# EAGLE design cyberspace-1-video-pico-card (EAGLE 9.6.2)
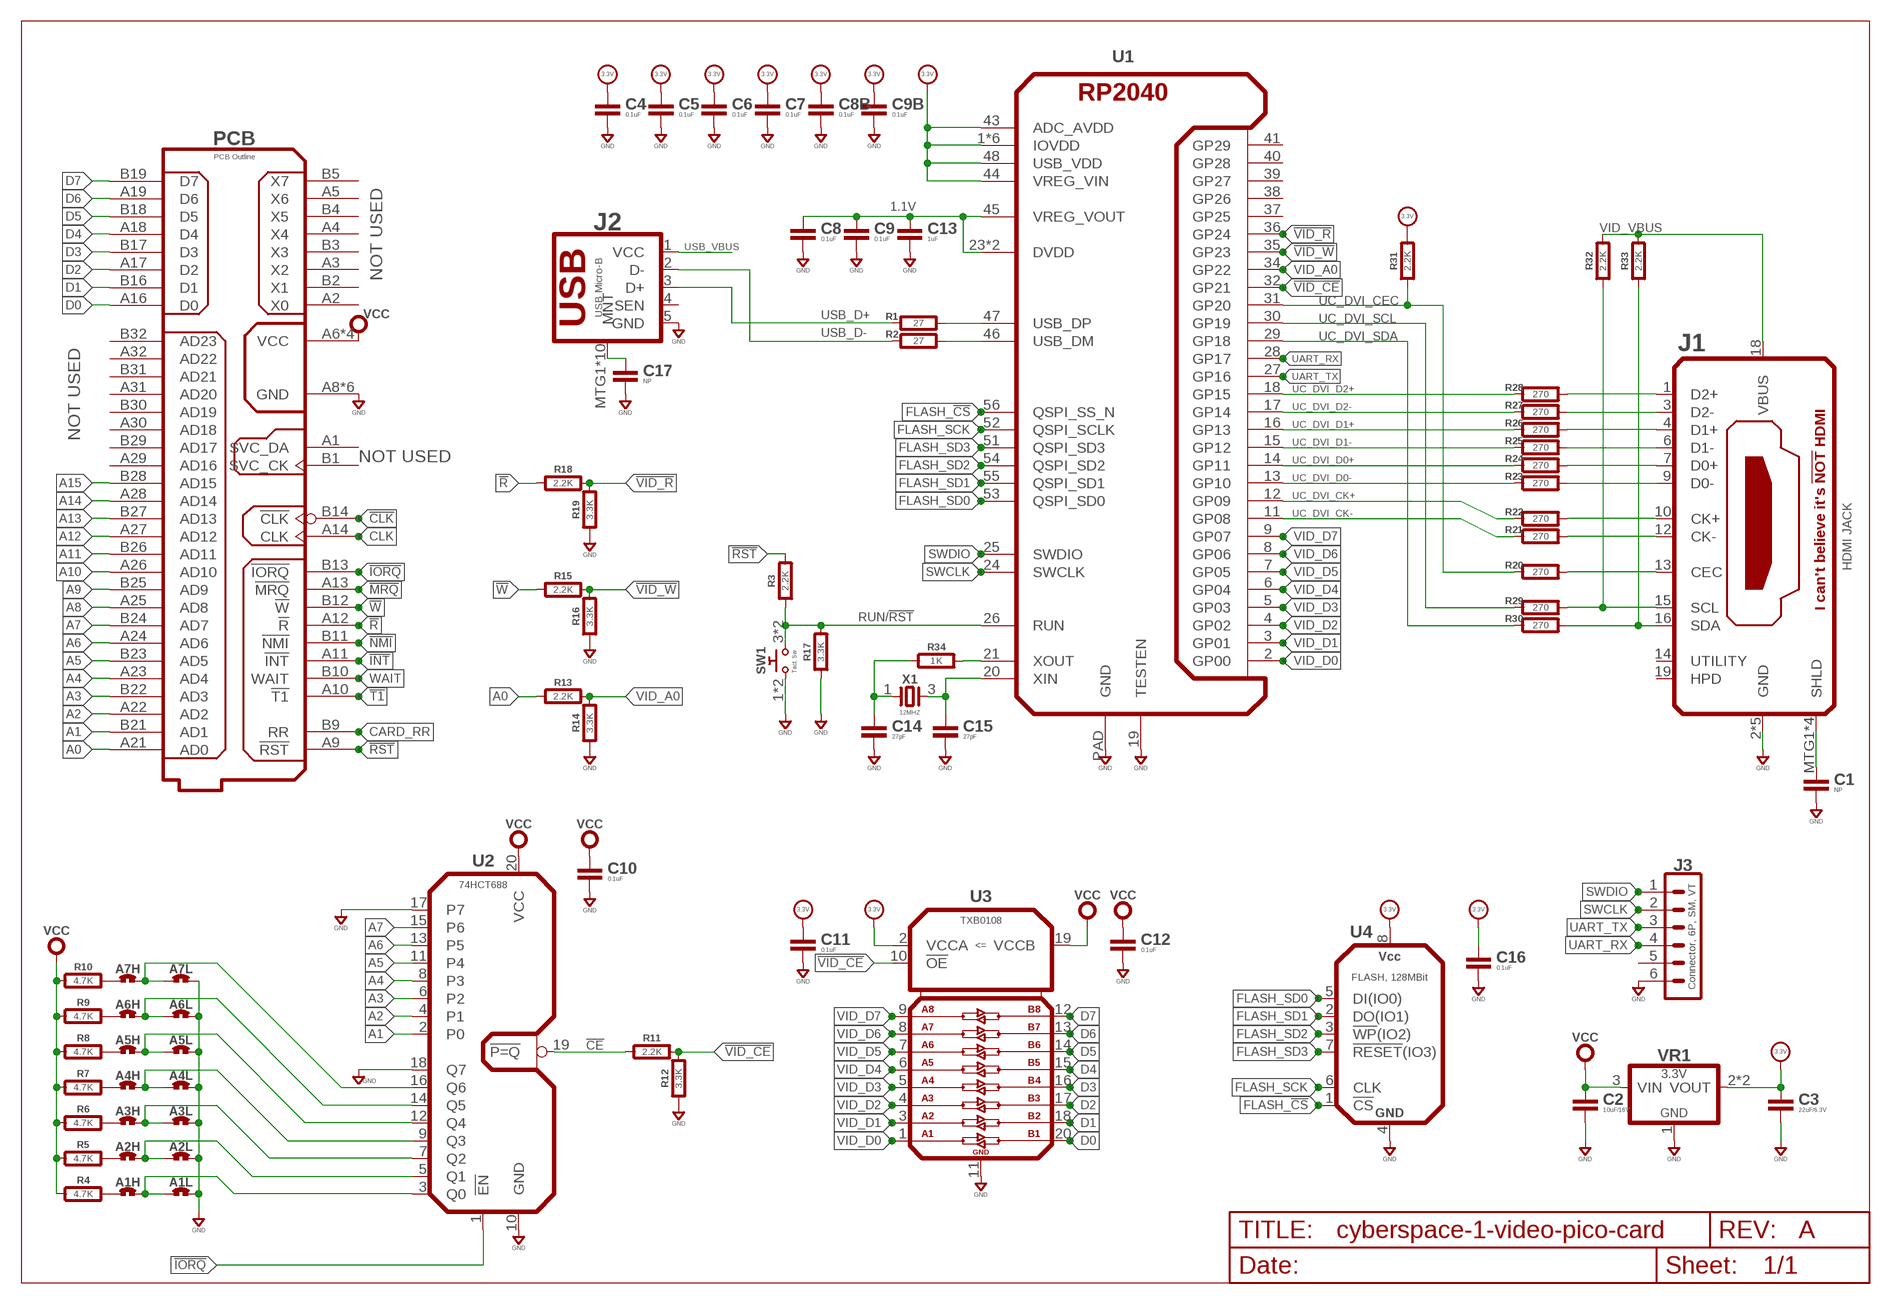
[diagram p0: schematic, sheet 1]
U$1 (DINA4_L-SMALLDOC): REV: A

## Parts
A1H  SOLDER_JUMPER-80MIL-RND  [SOLDER_JUMP_80MIL_RND]
A1L  SOLDER_JUMPER-80MIL-RND  [SOLDER_JUMP_80MIL_RND]
A2H  SOLDER_JUMPER-80MIL-RND  [SOLDER_JUMP_80MIL_RND]
A2L  SOLDER_JUMPER-80MIL-RND  [SOLDER_JUMP_80MIL_RND]
A3H  SOLDER_JUMPER-80MIL-RND  [SOLDER_JUMP_80MIL_RND]
A3L  SOLDER_JUMPER-80MIL-RND  [SOLDER_JUMP_80MIL_RND]
A4H  SOLDER_JUMPER-80MIL-RND  [SOLDER_JUMP_80MIL_RND]
A4L  SOLDER_JUMPER-80MIL-RND  [SOLDER_JUMP_80MIL_RND]
A5H  SOLDER_JUMPER-80MIL-RND  [SOLDER_JUMP_80MIL_RND]
A5L  SOLDER_JUMPER-80MIL-RND  [SOLDER_JUMP_80MIL_RND]
A6H  SOLDER_JUMPER-80MIL-RND  [SOLDER_JUMP_80MIL_RND]
A6L  SOLDER_JUMPER-80MIL-RND  [SOLDER_JUMP_80MIL_RND]
A7H  SOLDER_JUMPER-80MIL-RND  [SOLDER_JUMP_80MIL_RND]
A7L  SOLDER_JUMPER-80MIL-RND  [SOLDER_JUMP_80MIL_RND]
C1  NP  CAPACITOR0603  [0603-CAP]
C2  10uF/16V  CAPACITOR0805  [0805-CAP]
C3  22uF/6.3V  CAPACITOR0805  [0805-CAP]
C4  0.1uF  CAPACITOR0603  [0603-CAP]
C5  0.1uF  CAPACITOR0603  [0603-CAP]
C6  0.1uF  CAPACITOR0603  [0603-CAP]
C7  0.1uF  CAPACITOR0603  [0603-CAP]
C8  0.1uF  CAPACITOR0603  [0603-CAP]
C8B  0.1uF  CAPACITOR0603  [0603-CAP]
C9  0.1uF  CAPACITOR0603  [0603-CAP]
C9B  0.1uF  CAPACITOR0603  [0603-CAP]
C10  0.1uF  CAPACITOR0603  [0603-CAP]
C11  0.1uF  CAPACITOR0603  [0603-CAP]
C12  0.1uF  CAPACITOR0603  [0603-CAP]
C13  1uF  CAPACITOR0603  [0603-CAP]
C14  27pF  CAPACITOR0603  [0603-CAP]
C15  27pF  CAPACITOR0603  [0603-CAP]
C16  0.1uF  CAPACITOR0603  [0603-CAP]
C17  NP  CAPACITOR0603  [0603-CAP]
J1  HDMI JACK  HDMI-19JAE-DC1  [JAE-DC1-HDMI]
J2  USB Micro-B  USB-B-MICRO-SMTJAE-DX4R005  [JAE-DX4R005]
J3  Connector, 6P, SM, VT  06P-SM-VT-SMT  [BM06B-SRSS-TB]
PCB  PCB Outline  CYBERSPACE-1-CARD-1A  [CYBERSPACE-CARD-TYPE-1A]
R1  27  RESISTOR0603  [0603-RES]
R2  27  RESISTOR0603  [0603-RES]
R3  2.2K  RESISTOR0603  [0603-RES]
R4  4.7K  RESISTOR0603  [0603-RES]
R5  4.7K  RESISTOR0603  [0603-RES]
R6  4.7K  RESISTOR0603  [0603-RES]
R7  4.7K  RESISTOR0603  [0603-RES]
R8  4.7K  RESISTOR0603  [0603-RES]
R9  4.7K  RESISTOR0603  [0603-RES]
R10  4.7K  RESISTOR0603  [0603-RES]
R11  2.2K  RESISTOR0603  [0603-RES]
R12  3.3K  RESISTOR0603  [0603-RES]
R13  2.2K  RESISTOR0603  [0603-RES]
R14  3.3K  RESISTOR0603  [0603-RES]
R15  2.2K  RESISTOR0603  [0603-RES]
R16  3.3K  RESISTOR0603  [0603-RES]
R17  3.3K  RESISTOR0603  [0603-RES]
R18  2.2K  RESISTOR0603  [0603-RES]
R19  3.3K  RESISTOR0603  [0603-RES]
R20  270  RESISTOR0603  [0603-RES]
R21  270  RESISTOR0603  [0603-RES]
R22  270  RESISTOR0603  [0603-RES]
R23  270  RESISTOR0603  [0603-RES]
R24  270  RESISTOR0603  [0603-RES]
R25  270  RESISTOR0603  [0603-RES]
R26  270  RESISTOR0603  [0603-RES]
R27  270  RESISTOR0603  [0603-RES]
R28  270  RESISTOR0603  [0603-RES]
R29  270  RESISTOR0603  [0603-RES]
R30  270  RESISTOR0603  [0603-RES]
R31  2.2K  RESISTOR0603  [0603-RES]
R32  2.2K  RESISTOR0603  [0603-RES]
R33  2.2K  RESISTOR0603  [0603-RES]
R34  1K  RESISTOR0603  [0603-RES]
SW1  Tact. Sw.  PUSHBTN-MOMB3FS  [B3FS]
U1  RP2040-QFN  [QFN56-7X7]
U2  74HCT688  74HCT688PWR  [TSSOP20]
U3  TXB0108  TXB0108PWR  [TSSOP20]
U4  FLASH, 128MBit  FLASH_SERIAL128MBIT-SO8  [SOP08]
VR1  3.3V  LDO-3P-1117-3.3V  [SOT-223]
X1  12MHZ  2P32X25-12MHZ  [32X25]

## Nets
1.1V: C8.1 C9.1 C13.1 U1.23(DVDD) U1.45(VREG_VOUT) U1.50(DVDD)
!CE: R11.1 U2.19(!P=Q)
!CLK: PCB.B14(!CLK)
!INT: PCB.A11(!INT)
!IORQ: PCB.B13(!IORQ) U2.1(!EN)
!MRQ: PCB.A13(!MRQ)
!NMI: PCB.B11(!NMI)
!R: PCB.A12(!R) R18.1
!RST: PCB.A9(!RST) R3.2
!T1: PCB.A10(!T1)
!VID_CE: R11.2 R12.2 U1.32(GP21) U3.10(!OE)
!VID_R: R18.2 R19.2 U1.36(GP24)
!VID_W: R15.2 R16.2 U1.35(GP23)
!W: PCB.B12(!W) R15.1
+3.3V: C3.1 C4.1 C5.1 C6.1 C7.1 C8B.1 C9B.1 C11.1 C16.1 R31.2 U1.1(IOVDD) U1.10(IOVDD) U1.22(IOVDD) U1.33(IOVDD) U1.42(IOVDD) U1.43(ADC_AVDD) U1.44(VREG_VIN) U1.48(USB_VDD) U1.49(IOVDD) U3.2(VCCA) U4.8(VCC) VR1.2(VOUT) VR1.TAB(VOUT) ; supply symbol labelled 3.3V
A0: PCB.A21(AD0) R13.1
A1: PCB.B21(AD1) U2.2(P0)
A2: PCB.A22(AD2) U2.4(P1)
A3: PCB.B22(AD3) U2.6(P2)
A4: PCB.A23(AD4) U2.8(P3)
A5: PCB.B23(AD5) U2.11(P4)
A6: PCB.A24(AD6) U2.13(P5)
A7: PCB.B24(AD7) U2.15(P6)
A8: PCB.A25(AD8)
A9: PCB.B25(AD9)
A10: PCB.A26(AD10)
A11: PCB.B26(AD11)
A12: PCB.A27(AD12)
A13: PCB.B27(AD13)
A14: PCB.A28(AD14)
A15: PCB.B28(AD15)
CARD_RR: PCB.B9(RR)
CLK: PCB.A14(CLK)
D0: PCB.A16(D0) U3.20(B1)
D1: PCB.B16(D1) U3.18(B2)
D2: PCB.A17(D2) U3.17(B3)
D3: PCB.B17(D3) U3.16(B4)
D4: PCB.A18(D4) U3.15(B5)
D5: PCB.B18(D5) U3.14(B6)
D6: PCB.A19(D6) U3.13(B7)
D7: PCB.B19(D7) U3.12(B8)
FLASH_!CS: U1.56(QSPI_SS_N) U4.1(!CS)
FLASH_SCK: U1.52(QSPI_SCLK) U4.6(CLK)
FLASH_SD0: U1.53(QSPI_SD0) U4.5(DI(IO0))
FLASH_SD1: U1.55(QSPI_SD1) U4.2(DO(IO1))
FLASH_SD2: U1.54(QSPI_SD2) U4.3(!WP!(IO2))
FLASH_SD3: U1.51(QSPI_SD3) U4.7(!RESET!(IO3))
GND: A1L.2 A2L.2 A3L.2 A4L.2 A5L.2 A6L.2 A7L.2 C1.2 C2.2 C3.2 C4.2 C5.2 C6.2 C7.2 C8.2 C8B.2 C9.2 C9B.2 C10.2 C11.2 C12.2 C13.2 C14.2 C15.2 C16.2 C17.2 J1.2(GND) J1.5(GND) J1.8(GND) J1.11(GND) J1.17(GND) J2.5(GND) J3.6 PCB.A8(GND) PCB.A15(GND) PCB.A20(GND) PCB.B8(GND) PCB.B15(GND) PCB.B20(GND) R12.1 R14.1 R16.1 R17.1 R19.1 SW1.1 SW1.2 U1.19(TESTEN) U1.PAD(GND) U2.10(GND) U2.17(P7) U3.11(GND) U4.4(GND) VR1.1(GND)
N$1: J1.13(CEC) R20.2
N$2: R1.2 U1.47(USB_DP)
N$3: R2.2 U1.46(USB_DM)
N$4: J1.12(CK-) R21.2
N$5: J1.10(CK+) R22.2
N$6: J1.9(D0-) R23.2
N$7: J1.7(D0+) R24.2
N$8: J1.6(D1-) R25.2
N$9: J1.4(D1+) R26.2
N$10: J1.3(D2-) R27.2
N$11: A1H.1 R4.2
N$12: A1H.2 A1L.1 U2.3(Q0)
N$13: A2H.1 R5.2
N$14: A2H.2 A2L.1 U2.5(Q1)
N$15: A3H.1 R6.2
N$16: A3H.2 A3L.1 U2.7(Q2)
N$17: A4H.1 R7.2
N$18: A4H.2 A4L.1 U2.9(Q3)
N$19: A5H.1 R8.2
N$20: A5H.2 A5L.1 U2.12(Q4)
N$21: A6H.1 R9.2
N$22: A6H.2 A6L.1 U2.14(Q5)
N$23: A7H.1 R10.2
N$24: A7H.2 A7L.1 U2.16(Q6)
N$25: J1.1(D2+) R28.2
N$26: J1.15(SCL) R29.2 R32.1
N$27: J1.16(SDA) R30.2 R33.1
N$28: C1.1 J1.MTG1(SHLD) J1.MTG2(SHLD) J1.MTG3(SHLD) J1.MTG4(SHLD)
N$29: U2.18(Q7) ; supply symbol labelled GND
N$30: R34.2 U1.21(XOUT)
N$31: C14.1 R34.1 X1.1
N$32: C15.1 U1.20(XIN) X1.3
N$33: C17.1 J2.MTG1(MNT) J2.MTG2(MNT) J2.MTG3(MNT) J2.MTG4(MNT) J2.MTG5(MNT) J2.MTG6(MNT) J2.MTG7(MNT) J2.MTG8(MNT) J2.MTG9(MNT) J2.MTG10(MNT)
RUN/!RST: R3.1 R17.2 SW1.3 SW1.4 U1.26(RUN)
SWCLK: J3.2 U1.24(SWCLK)
SWDIO: J3.1 U1.25(SWDIO)
UART_RX: J3.4 U1.28(GP17)
UART_TX: J3.3 U1.27(GP16)
UC_DVI_CEC: R20.1 R31.1 U1.31(GP20)
UC_DVI_CK+: R22.1 U1.12(GP09)
UC_DVI_CK-: R21.1 U1.11(GP08)
UC_DVI_D0+: R24.1 U1.14(GP11)
UC_DVI_D0-: R23.1 U1.13(GP10)
UC_DVI_D1+: R26.1 U1.16(GP13)
UC_DVI_D1-: R25.1 U1.15(GP12)
UC_DVI_D2+: R28.1 U1.18(GP15)
UC_DVI_D2-: R27.1 U1.17(GP14)
UC_DVI_SCL: R29.1 U1.30(GP19)
UC_DVI_SDA: R30.1 U1.29(GP18)
USB_D+: J2.3(D+) R1.1
USB_D-: J2.2(D-) R2.1
USB_VBUS: J2.1(VCC)
VCC: C2.1 C10.1 C12.1 PCB.A6(VCC) PCB.A7(VCC) PCB.B6(VCC) PCB.B7(VCC) R4.1 R5.1 R6.1 R7.1 R8.1 R9.1 R10.1 U2.20(VCC) U3.19(VCCB) VR1.3(VIN)
VID_A0: R13.2 R14.2 U1.34(GP22)
VID_D0: U1.2(GP00) U3.1(A1)
VID_D1: U1.3(GP01) U3.3(A2)
VID_D2: U1.4(GP02) U3.4(A3)
VID_D3: U1.5(GP03) U3.5(A4)
VID_D4: U1.6(GP04) U3.6(A5)
VID_D5: U1.7(GP05) U3.7(A6)
VID_D6: U1.8(GP06) U3.8(A7)
VID_D7: U1.9(GP07) U3.9(A8)
VID_VBUS: J1.18(VBUS) R32.2 R33.2
WAIT: PCB.B10(WAIT)
Unconnected: J1.14(UTILITY) J1.19(HPD) J2.4(SEN) J3.5 PCB.A1(SVC_DA) PCB.A2(X0) PCB.A3(X2) PCB.A4(X4) PCB.A5(X6) PCB.A29(AD16) PCB.A30(AD18) PCB.A31(AD20) PCB.A32(AD22) PCB.B1(SVC_CK) PCB.B2(X1) PCB.B3(X3) PCB.B4(X5) PCB.B5(X7) PCB.B29(AD17) PCB.B30(AD19) PCB.B31(AD21) PCB.B32(AD23) U1.37(GP25) U1.38(GP26) U1.39(GP27) U1.40(GP28) U1.41(GP29)

## Notes on the sheet
- NOT USED
- NOT USED
- NOT USED

## Library data of the parts
A1H A1L A2H A2L A3H A3L A4H A4L A5H A5L A6H A6L A7H A7L = rlc:SOLDER_JUMPER
C1-C8 C8B C9 C9B C10-C17 = rlc:CAPACITOR: Capacitor; COST01: 0.12; COST10: 0.09; COST100: 0.05
J1 = con-usb:HDMI-19: HDMI, 19P; COST01: 1.20; COST10: 0.95; COST100: 0.82; MFR: JAE; MPN: DC1Rx19JA
J2 = con-usb:USB-B-MICRO-SMT: USB Micro - B-style; COST01: 0.85; COST10: 0.65; COST100: 0.55; MFR: JAE; MPN: DX4R005JJ2R1800; OC_MOUSER: https://www.mouser.com/ProductDetail/DX4R005JJ2R1800
J3 = con-jst:06P: Connector, 6P; COST01: 0.60; COST10: 0.52; COST100: 0.49; MFR: JST; MPN: BM06-SRSS-TB
PCB = con-edge:CYBERSPACE-1-CARD: Card for the CyberSpace 1 System
R1-R34 = rlc:RESISTOR: Resistor; COST01: 0.10; COST10: 0.05; COST100: 0.02
SW1 = switch-smd:PUSHBTN-MOM: Pushbutton Switch; MFR: Omron; MPN: B3FS-10*
U1 = co-raspberrypi:RP2040: Raspi 2040 Microcontroller
U2 = logic:74*688?: 74x688 Magnitude Comparitor; COST01: 1.60; COST10: 1.40; COST100: 1.10; MFR: TI; MPN: DC74HCT688PWR
U3 = logic:TXB0108*: Bidirectional 8-bit bus tranceiver and voltage level shifter.; COST01: 1.65; COST10: 1.45; COST100: 1.10; MFR: TI; MPN: TXB0108PWR
U4 = logic:FLASH_SERIAL: Flash, Serial; COST01: 1.75; COST10: 1.55; COST100: 1.35; MFR: Winbond; MPN: W25Q128JVS
VR1 = regulators:LDO-3P-: regulator 3-pin; COST01: 0.40; COST10: 0.32; COST100: 0.19; MPN: AZ1117-3.3
X1 = xtal:2P: Crystal; COST01: 0.45; COST10: 0.35; COST100: 0.30; MFR: ABRICON; MPN: ABM8G-12-18D2Y

## Board
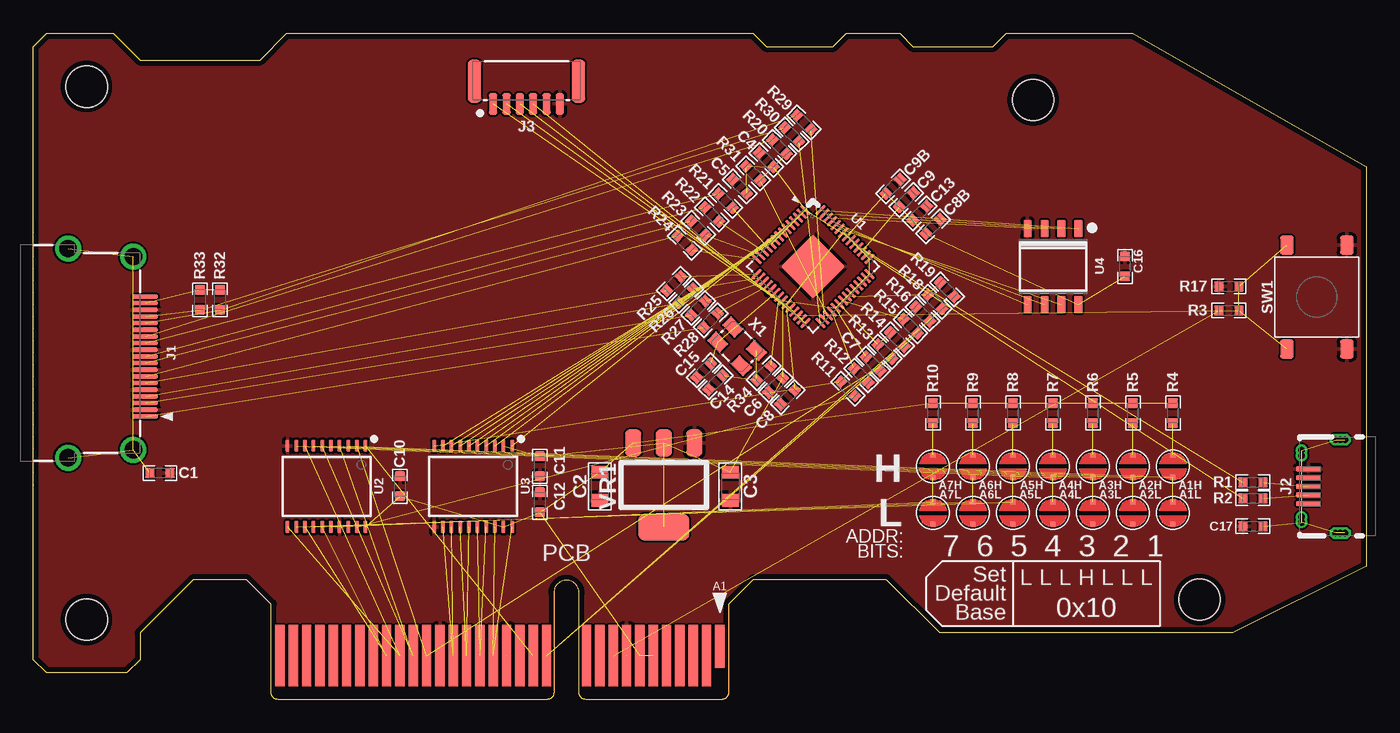
[diagram p1: board, top side]
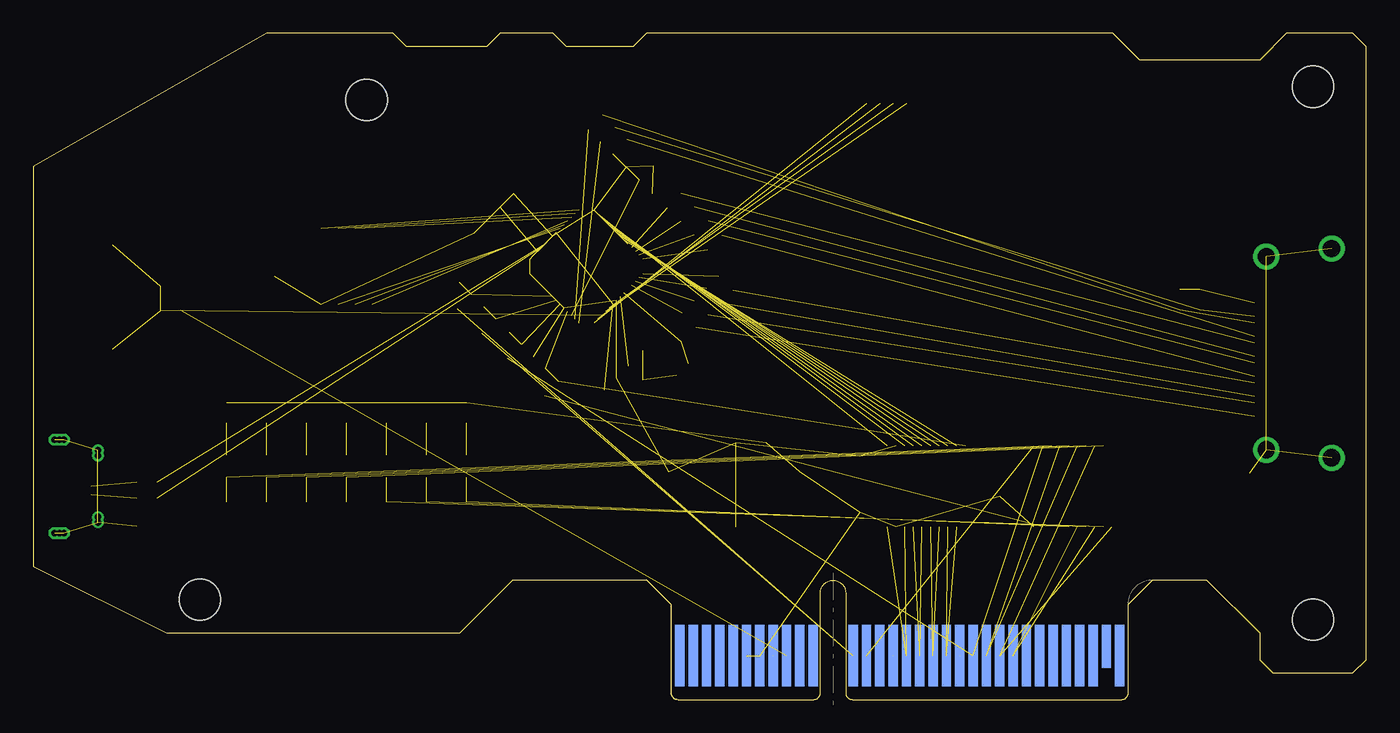
[diagram p2: board, bottom side, seen from below]

Size 100 x 50 mm. Coordinates in mm from the lower left corner, seen from the top.
Copper layers (1*16): Top 0.0356mm / dielectric 1.5011mm / Bottom 0.0356mm
Design rules "OSH-CircuitMonkey": minimum track width 6mil, minimum drill 12mil, track to track 6mil, track to pad 6mil, pad to pad 6mil, via to via 6mil, smd to smd 6mil, copper to edge 15mil, drill to drill 6mil, minimum pad ring 7mil, minimum via ring 7mil, stop-mask expansion 3mil, vias tented up to drill 13mil, thermal gap 10mil

### Footprints (pad centres in the part's own frame; a part is rotated, then mirrored left to right if it is on the bottom)
SOLDER_JUMP_80MIL_RND = smd 0.406 x 0.406: 1 -0.838,0; 2 0.838,0
0603-CAP = smd 0.711 x 0.762: 1 -0.752,0; 2 0.752,0
0805-CAP = smd 1.016 x 1.321: 1 -1.067,0; 2 1.067,0
JAE-DC1-HDMI = smd 0.3 x 1.9: 1 4.75,8.4; 2 4.25,8.4; 3 3.75,8.4; 4 3.25,8.4; 5 2.75,8.4; 6 2.25,8.4; 7 1.75,8.4; 8 1.25,8.4; 9 0.75,8.4; 10 0.25,8.4; 11 -0.25,8.4; 12 -0.75,8.4; 13 -1.25,8.4; 14 -1.75,8.4; 15 -2.25,8.4; 16 -2.75,8.4; 17 -3.25,8.4; 18 -3.75,8.4; 19 -4.25,8.4 | drill 1.3: MTG1 7.85,2.6; MTG2 7.25,7.5; MTG3 -7.85,2.6; MTG4 -7.25,7.5
JAE-DX4R005 = smd 0.4 x 1.8: 1 -1.3,4.35; 2 -0.65,4.35; 3 0,4.35; 4 0.65,4.35; 5 1.3,4.35 | drill 0.5 octagon: MTG1 -3.5,1.95; MTG2 3.5,1.95; MTG7 -3.5,2.3; MTG8 -3.5,1.6; MTG9 3.5,2.3; MTG10 3.5,1.6 | drill 0.5: MTG3 -2.701,4.85; MTG4 2.701,4.85; MTG5 -2.299,4.85; MTG6 2.299,4.85
BM06B-SRSS-TB = smd 0.6 x 1.6: 1 -2.5,-0.3; 2 -1.5,-0.3; 3 -0.5,-0.3; 4 0.5,-0.3; 5 1.5,-0.3; 6 2.5,-0.3 | smd 1 x 3.2: MTG1 3.9,1.4; MTG2 -3.9,1.4
CYBERSPACE-CARD-TYPE-1A = smd 0.7 x 3.2: A1 11.5,4 | smd 0.7 x 4.6: A2 10.5,3.3; A3 9.5,3.3; A4 8.5,3.3; A5 7.5,3.3; A6 6.5,3.3; A7 5.5,3.3; A8 4.5,3.3; A9 3.5,3.3; A10 2.5,3.3; A11 1.5,3.3; A12 -1.5,3.3; A13 -2.5,3.3; A14 -3.5,3.3; A15 -4.5,3.3; A16 -5.5,3.3; A17 -6.5,3.3; A18 -7.5,3.3; A19 -8.5,3.3; A20 -9.5,3.3; A21 -10.5,3.3; A22 -11.5,3.3; A23 -12.5,3.3; A24 -13.5,3.3; A25 -14.5,3.3; A26 -15.5,3.3; A27 -16.5,3.3; A28 -17.5,3.3; A29 -18.5,3.3; A30 -19.5,3.3; A31 -20.5,3.3; A32 -21.5,3.3 | smd 0.7 x 4.6 bottom: B1 11.5,3.3; B2 10.5,3.3; B3 9.5,3.3; B4 8.5,3.3; B5 7.5,3.3; B6 6.5,3.3; B7 5.5,3.3; B8 4.5,3.3; B9 3.5,3.3; B10 2.5,3.3; B11 1.5,3.3; B12 -1.5,3.3; B13 -2.5,3.3; B14 -3.5,3.3; B15 -4.5,3.3; B16 -5.5,3.3; B17 -6.5,3.3; B18 -7.5,3.3; B19 -8.5,3.3; B20 -9.5,3.3; B21 -10.5,3.3; B22 -11.5,3.3; B23 -12.5,3.3; B24 -13.5,3.3; B25 -14.5,3.3; B26 -15.5,3.3; B27 -16.5,3.3; B28 -17.5,3.3; B29 -18.5,3.3; B30 -19.5,3.3; B32 -21.5,3.3 | smd 0.7 x 3.2 bottom: B31 -20.5,4 | hole 3.1: -36,46; -36,6; 47.5,7.5; 35,45
0603-RES = smd 0.711 x 0.762: 1 -0.752,0; 2 0.752,0
B3FS = smd 1.4 x 1: 1 3.9,-2.25; 2 -3.9,-2.25; 3 3.9,2.25; 4 -3.9,2.25
QFN56-7X7 = smd 1 x 0.24: 1 -3.4,2.6; 2 -3.4,2.2; 3 -3.4,1.8; 4 -3.4,1.4; 5 -3.4,1; 6 -3.4,0.6; 7 -3.4,0.2; 8 -3.4,-0.2; 9 -3.4,-0.6; 10 -3.4,-1; 11 -3.4,-1.4; 12 -3.4,-1.8; 13 -3.4,-2.2; 14 -3.4,-2.6; 29 3.4,-2.6; 30 3.4,-2.2; 31 3.4,-1.8; 32 3.4,-1.4; 33 3.4,-1; 34 3.4,-0.6; 35 3.4,-0.2; 36 3.4,0.2; 37 3.4,0.6; 38 3.4,1; 39 3.4,1.4; 40 3.4,1.8; 41 3.4,2.2; 42 3.4,2.6 | smd 0.24 x 1: 15 -2.6,-3.4; 16 -2.2,-3.4; 17 -1.8,-3.4; 18 -1.4,-3.4; 19 -1,-3.4; 20 -0.6,-3.4; 21 -0.2,-3.4; 22 0.2,-3.4; 23 0.6,-3.4; 24 1,-3.4; 25 1.4,-3.4; 26 1.8,-3.4; 27 2.2,-3.4; 28 2.6,-3.4; 43 2.6,3.4; 44 2.2,3.4; 45 1.8,3.4; 46 1.4,3.4; 47 1,3.4; 48 0.6,3.4; 49 0.2,3.4; 50 -0.2,3.4; 51 -0.6,3.4; 52 -1,3.4; 53 -1.4,3.4; 54 -1.8,3.4; 55 -2.2,3.4; 56 -2.6,3.4 | smd 3.4 x 3.4: PAD 0,0
TSSOP20 = smd 0.32 x 0.95: 1 -2.925,-3.05; 2 -2.275,-3.05; 3 -1.625,-3.05; 4 -0.975,-3.05; 5 -0.325,-3.05; 6 0.325,-3.05; 7 0.975,-3.05; 8 1.625,-3.05; 9 2.275,-3.05; 10 2.925,-3.05; 11 2.925,3.05; 12 2.275,3.05; 13 1.625,3.05; 14 0.975,3.05; 15 0.325,3.05; 16 -0.325,3.05; 17 -0.975,3.05; 18 -1.625,3.05; 19 -2.275,3.05; 20 -2.925,3.05
SOP08 = smd 0.6 x 1.3: 1 -1.905,-2.85; 2 -0.635,-2.85; 3 0.635,-2.85; 4 1.905,-2.85; 5 1.905,2.85; 6 0.635,2.85; 7 -0.635,2.85; 8 -1.905,2.85
SOT-223 = smd 2 x 1.2: 1 3.15,-2.3; 2 3.15,0; 3 3.15,2.3 | smd 2 x 3.8: TAB -3.15,0
32X25 = smd 1.4 x 1: 1 -1.25,-0.8; 2 1.25,-0.8; 3 1.25,0.8; 4 -1.25,0.8

### Placement (x,y rotation side)
A1H  85.5,17.5 270 top
A1L  85.5,14 270 top
A2H  82.5,17.5 270 top
A2L  82.5,14 270 top
A3H  79.5,17.5 270 top
A3L  79.5,14 270 top
A4H  76.5,17.5 270 top
A4L  76.5,14 270 top
A5H  73.5,17.5 270 top
A5L  73.5,14 270 top
A6H  70.5,17.5 270 top
A6L  70.5,14 270 top
A7H  67.5,17.5 270 top
A7L  67.5,14 270 top
C1  9.5,17 0 top
C2  42.5,16 270 top
C3  52.3,16 270 top
C4  55,40.5 135 top
C5  53,38.5 135 top
C6  55.7,23.6 225 top
C7  63,25.2 315 top
C8  56.6,22.7 225 top
C8B  67.5,35.5 45 top
C9  65.5,37.5 45 top
C9B  64.5,38.5 45 top
C10  27.5,16 90 top
C11  38,17.5 270 top
C12  38,14.8 90 top
C13  66.5,36.5 45 top
C14  51.2,23.8 225 top
C15  50.3,24.7 225 top
C16  81.9,32.5 90 top
C17  91.5,13 180 top
J1  0,26 270 top
J2  100,16 90 top
J3  37,45 0 top
PCB  40,0 0 top
R1  91.5,16.3 180 top
R2  91.5,15.1 180 top
R3  89.7,29.2 180 top
R4  85.5,21.5 270 top
R5  82.5,21.5 270 top
R6  79.5,21.5 270 top
R7  76.5,21.5 270 top
R8  73.5,21.5 270 top
R9  70.5,21.5 270 top
R10  67.5,21.5 270 top
R11  61.12,23.33 135 top
R12  62.11,24.32 135 top
R13  63.9,26.11 135 top
R14  64.82,27.03 135 top
R15  65.81,28.02 135 top
R16  66.72,28.94 135 top
R17  89.7,31 0 top
R18  67.64,29.86 135 top
R19  68.56,30.77 135 top
R20  55.98,41.48 135 top
R21  51.93,37.43 135 top
R22  50.91,36.41 135 top
R23  49.89,35.39 135 top
R24  48.87,34.27 135 top
R25  48.06,31.22 225 top
R26  48.98,30.3 225 top
R27  49.89,29.38 225 top
R28  50.81,28.46 225 top
R29  57.82,43.32 135 top
R30  56.9,42.4 135 top
R31  54,39.5 135 top
R32  14,30 90 top
R33  12.5,30 90 top
R34  54.8,24.5 45 top
SW1  96.3,30.2 90 top
U1  58.5,32.5 315 top
U2  22,16 180 top
U3  33,16 180 top
U4  76.5,32.5 180 top
VR1  47.3,16.1 90 top
X1  52.8,26.5 135 top

### Tracks (layer width: path | path; a pad name or v marks a point on that pad's centre or on a via)
1.1V  (5 unrouted)
!CE  (1 unrouted)
!IORQ  (1 unrouted)
!R  (1 unrouted)
!RST  (1 unrouted)
!VID_CE  (3 unrouted)
!VID_R  (2 unrouted)
!VID_W  (2 unrouted)
!W  (1 unrouted)
+3.3V  (22 unrouted)
A0  (1 unrouted)
A1  (1 unrouted)
A2  (1 unrouted)
A3  (1 unrouted)
A4  (1 unrouted)
A5  (1 unrouted)
A6  (1 unrouted)
A7  (1 unrouted)
D0  (1 unrouted)
D1  (1 unrouted)
D2  (1 unrouted)
D3  (1 unrouted)
D4  (1 unrouted)
D5  (1 unrouted)
D6  (1 unrouted)
D7  (1 unrouted)
FLASH_!CS  (1 unrouted)
FLASH_SCK  (1 unrouted)
FLASH_SD0  (1 unrouted)
FLASH_SD1  (1 unrouted)
FLASH_SD2  (1 unrouted)
FLASH_SD3  (1 unrouted)
GND  (3 unrouted)
  pour Top: 1,2 0,3 0,49 1,50 6,50 8,48 17,48 19,50 54,50 55,49 60,49 61,50 65,50 66,49 72,49 73,50 82.92,50 100,39.96 100,9.94 90,4.96 68,5 64,9 54,9 52,7 52,5 18,5 18,7 16,9 12,9 8,5 8,3 7,2
N$1  (1 unrouted)
N$2  (1 unrouted)
N$3  (1 unrouted)
N$4  (1 unrouted)
N$5  (1 unrouted)
N$6  (1 unrouted)
N$7  (1 unrouted)
N$8  (1 unrouted)
N$9  (1 unrouted)
N$10  (1 unrouted)
N$11  (1 unrouted)
N$12  (2 unrouted)
N$13  (1 unrouted)
N$14  (2 unrouted)
N$15  (1 unrouted)
N$16  (2 unrouted)
N$17  (1 unrouted)
N$18  (2 unrouted)
N$19  (1 unrouted)
N$20  (2 unrouted)
N$21  (1 unrouted)
N$22  (2 unrouted)
N$23  (1 unrouted)
N$24  (2 unrouted)
N$25  (1 unrouted)
N$26  (2 unrouted)
N$27  (2 unrouted)
N$28  (4 unrouted)
N$30  (1 unrouted)
N$31  (2 unrouted)
N$32  (2 unrouted)
N$33  (10 unrouted)
RUN/!RST  (4 unrouted)
SWCLK  (1 unrouted)
SWDIO  (1 unrouted)
UART_RX  (1 unrouted)
UART_TX  (1 unrouted)
UC_DVI_CEC  (2 unrouted)
UC_DVI_CK+  (1 unrouted)
UC_DVI_CK-  (1 unrouted)
UC_DVI_D0+  (1 unrouted)
UC_DVI_D0-  (1 unrouted)
UC_DVI_D1+  (1 unrouted)
UC_DVI_D1-  (1 unrouted)
UC_DVI_D2+  (1 unrouted)
UC_DVI_D2-  (1 unrouted)
UC_DVI_SCL  (1 unrouted)
UC_DVI_SDA  (1 unrouted)
USB_D+  (1 unrouted)
USB_D-  (1 unrouted)
VCC  (16 unrouted)
VID_A0  (2 unrouted)
VID_D0  (1 unrouted)
VID_D1  (1 unrouted)
VID_D2  (1 unrouted)
VID_D3  (1 unrouted)
VID_D4  (1 unrouted)
VID_D5  (1 unrouted)
VID_D6  (1 unrouted)
VID_D7  (1 unrouted)
VID_VBUS  (2 unrouted)

### Text on the board
tPlace: H / L | ADDR: / BITS: | 7 6 5 4 3 2 1 | L L L H L L L | Set / Default / Base | 0x10
tStop: VIDEO